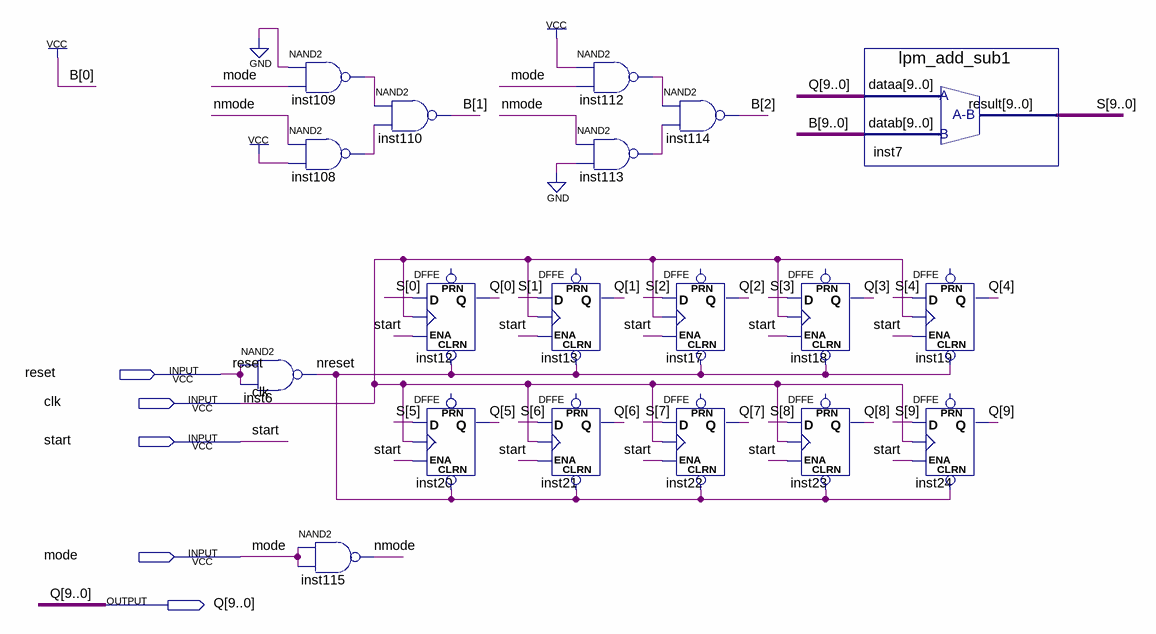
[diagram p0: schematic sheet]
// Quartus schematic coursework_substractor.bdf as structural Verilog: 19 symbols, 5 pins
module coursework_substractor (
  input  reset,
  input  clk,
  input  start,
  input  mode,
  output [9:0] Q
);

  wire inst108_out, inst109_out, inst112_out, inst113_out, nmode, nreset;
  wire [9:0] S;
  wire [9:1] B;

  nand inst6 (nreset, reset, reset);
  nand inst109 (inst109_out, 1'b0, mode);
  nand inst108 (inst108_out, nmode, 1'b1);
  nand inst115 (nmode, mode, mode);
  nand inst110 (B[1], inst109_out, inst108_out);
  DFFE inst12 (.CLRN(nreset), .D(S[0]), .CLK(clk), .ENA(start), .Q(Q[0]));  // open: PRN
  DFFE inst20 (.CLRN(nreset), .D(S[5]), .CLK(clk), .ENA(start), .Q(Q[5]));  // open: PRN
  DFFE inst13 (.CLRN(nreset), .D(S[1]), .CLK(clk), .ENA(start), .Q(Q[1]));  // open: PRN
  DFFE inst21 (.CLRN(nreset), .D(S[6]), .CLK(clk), .ENA(start), .Q(Q[6]));  // open: PRN
  nand inst112 (inst112_out, 1'b1, mode);
  nand inst113 (inst113_out, nmode, 1'b0);
  nand inst114 (B[2], inst112_out, inst113_out);
  DFFE inst17 (.CLRN(nreset), .D(S[2]), .CLK(clk), .ENA(start), .Q(Q[2]));  // open: PRN
  DFFE inst22 (.CLRN(nreset), .D(S[7]), .CLK(clk), .ENA(start), .Q(Q[7]));  // open: PRN
  DFFE inst18 (.CLRN(nreset), .D(S[3]), .CLK(clk), .ENA(start), .Q(Q[3]));  // open: PRN
  DFFE inst23 (.CLRN(nreset), .D(S[8]), .CLK(clk), .ENA(start), .Q(Q[8]));  // open: PRN
  lpm_add_sub1 inst7 (.dataa(Q), .datab({B, 1'b1}), .result(S));
  DFFE inst19 (.CLRN(nreset), .D(S[4]), .CLK(clk), .ENA(start), .Q(Q[4]));  // open: PRN
  DFFE inst24 (.CLRN(nreset), .D(S[9]), .CLK(clk), .ENA(start), .Q(Q[9]));  // open: PRN
endmodule
